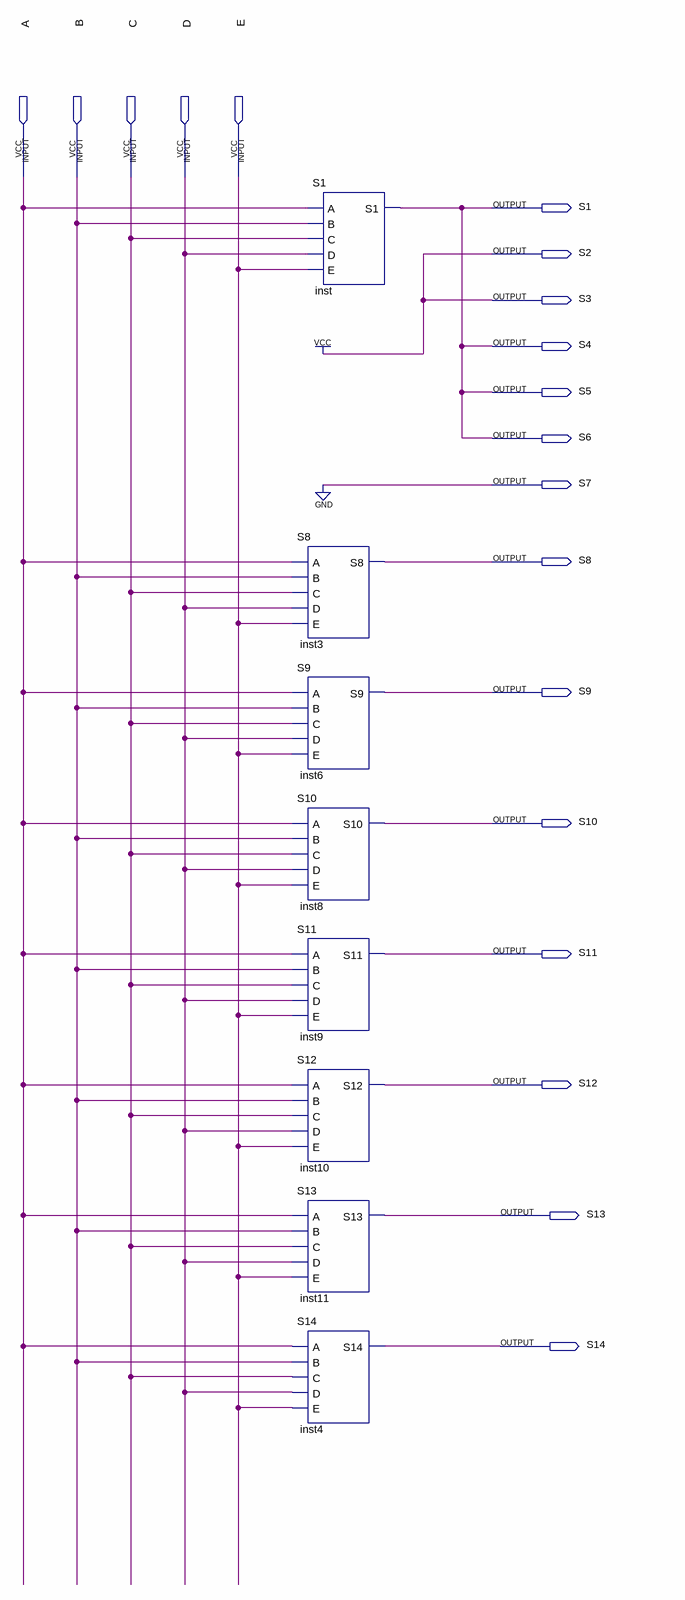
[diagram p0: schematic sheet]
// Quartus schematic Decodificador.bdf as structural Verilog: 8 symbols, 19 pins
module Decodificador (
  input  A,
  input  B,
  input  C,
  input  D,
  input  E,
  output S1,
  output S2,
  output S3,
  output S4,
  output S5,
  output S6,
  output S7,
  output S8,
  output S9,
  output S10,
  output S11,
  output S12,
  output S13,
  output S14
);

  S1 inst (.A(A), .B(B), .C(C), .D(D), .E(E), .S1(S1));
  S8 inst3 (.A(A), .B(B), .C(C), .D(D), .E(E), .S8(S8));
  S9 inst6 (.A(A), .B(B), .C(C), .D(D), .E(E), .S9(S9));
  S10 inst8 (.A(A), .B(B), .C(C), .D(D), .E(E), .S10(S10));
  S11 inst9 (.A(A), .B(B), .C(C), .D(D), .E(E), .S11(S11));
  S12 inst10 (.A(A), .B(B), .C(C), .D(D), .E(E), .S12(S12));
  S13 inst11 (.A(A), .B(B), .C(C), .D(D), .E(E), .S13(S13));
  S14 inst4 (.A(A), .B(B), .C(C), .D(D), .E(E), .S14(S14));

  assign S2 = 1'b1;
  assign S3 = 1'b1;
  assign S4 = S1;
  assign S5 = S1;
  assign S6 = S1;
  assign S7 = 1'b0;
endmodule
